# Altium schematic sheet JTAG.SchDoc
size A4; PageSetup: Record=PageOptions|CenterHorizontal=True|CenterVertical=True|PrintScale=0.94|XCorrection=1.00|YCorrection=1.00|PrintKind=1|BorderSize=5000000|LeftOffset=0|BottomOffset=0|Orientation=1|PaperLength=1000|PaperWidth=1000|Scale=100|PaperSource=7|PrintQuality=-4|MediaType=1|DitherType=10|PaperKind=A4|PrintScaleMode=1; DecimalNumber: Децимальный номер; HeadOfSector: Нач. сектора; MainDevice: Перв.примен.; Name: Наименование; Organization: Altium Limited; Address1: L3, 12a Rodborough Rd; Address2: Frenchs Forest; Address3: NSW; Address4: Australia 2086
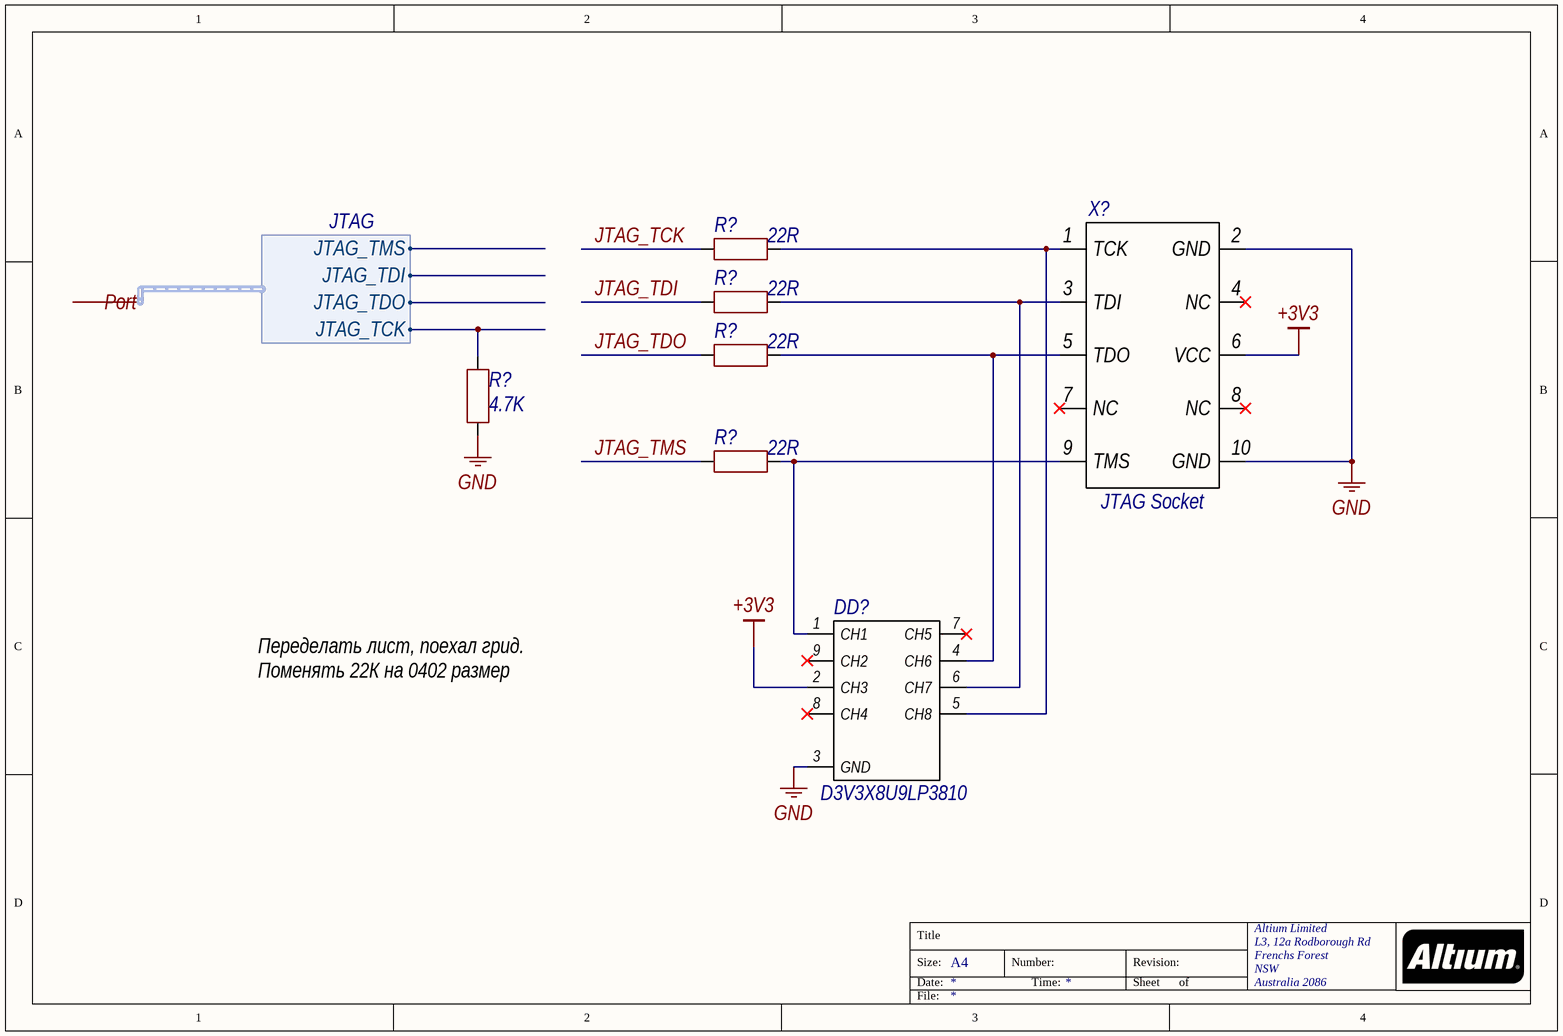
[diagram p0: JTAG.SchDoc]

## Parts
(Parts that share a designator on the sheet are numbered #1, #2 ... from top to bottom, then left to right.)
DD?  MPN: D3V3X8U9LP3810  [U-DFN3810-9]
R?#1  22R  [RESC0603N]
R?#2  22R  [RESC0603N]
R?#3  22R  [RESC0603N]
R?#4  4.7K  [RESC0402(1005)_M]
R?#5  22R  [RESC0603N]
X?  JTAG Socket  [BH-10]

## Ports
Port (harness JTAG)

## Harnesses
JTAG: JTAG_TCK, JTAG_TDI, JTAG_TDO, JTAG_TMS

## Nets
+3V3: DD?.2(CH3) X?.6(VCC)
GND: DD?.3(GND) R?#4.1 X?.2(GND) X?.10(GND)
JTAG_TCK: R?#1.1
JTAG_TDI: R?#2.1
JTAG_TDO: R?#3.1
JTAG_TMS: R?#5.1
NetDD?_1: DD?.1(CH1) R?#5.2 X?.9(TMS)
NetDD?_4: DD?.4(CH6) R?#3.2 X?.5(TDO)
NetDD?_5: DD?.5(CH8) R?#1.2 X?.1(TCK)
NetDD?_6: DD?.6(CH7) R?#2.2 X?.3(TDI)
NetR?#4_2: R?#4.2 ; port Port.JTAG_TCK

Not connected (* = marked no-connect by the designer): DD? 7(CH5)* 8(CH4)* 9(CH2)*; X? 4(NC)* 7(NC)* 8(NC)*

## Notes on the sheet
- Переделать лист, поехал грид. Поменять 22К на 0402 размер
- Title
- Size:
- Date:
- A4
- Number:
- Time:
- Revision:
- Sheet
- of
- File:

## Library data of the parts
DD? = D3V3X8U9LP3810: Manufacturer: DiodesInc; MntType: SMD; Part Number: D3V3X8U9LP3810; MSL: MSL 1; Package: =Footprint; RoHS: Comply; PartType: TVS; Pins: 9; BOMDescription: D3V3X8U9LP3810; CFootprint: =Footprint; ClassName: TVS; ComponentLink1Description: Datasheet; ComponentLink1URL: https://www.diodes.com/assets/Datasheets/D3V3X8U9LP3810.pdf
R?#1-R?#3 R?#5 = RES: Manufacturer: UNI-ROYAL; ManufacturerAlt: JLCPCB; MPN: 0603WAF220JT5E; MPNAlt: C23345; MntType: SMD; Tolerance: 1%; Voltage: 75V; Height: 0.45mm; MSL: MSL 1; Package: =Footprint; RoHS: Comply; PartType: CHIP RESISTOR; Pins: 2; BOMDescription: =MntType+' '+PartType+' '+Package+' '+Value+' '+Tolerance+' '+Voltage+' '+TempCoeff+' '+MPN; CFootprint: =Footprint; Value: 22R; Part Number: RES; ClassName: Resistor; ComponentLink1Description: Datasheet; ComponentLink1Description: New link; ComponentLink1URL: https://datasheet.lcsc.com/lcsc/1810291812_UNI-ROYAL-Uniroyal-Elec-0603WAF220JT5E_C23345.pdf
R?#4 = RES0402: Manufacturer: UNI-ROYAL; ManufacturerAlt: JLCPCB; MPN: 0402WGF4701TCE; MPNAlt: C25900; MntType: SMD; Tolerance: 1%; Voltage: 50V; Height: 0.35mm; MSL: MSL 1; Package: =Footprint; RoHS: Comply; PartType: CHIP RESISTOR; Pins: 2; BOMDescription: =MntType+' '+PartType+' '+Package+' '+Value+' '+Tolerance+' '+Voltage+' '+TempCoeff+' '+MPN; CFootprint: =Footprint; Value: 4.7K; Part Number: RES0402; ClassName: Resistor; ComponentLink1Description: Datasheet
X? = JTAG Socket 10 Pin: MntType: DIP; System: Connector; ComponentLink1Description: Datasheet; MPN: BH-10; Part Number: JTAG Socket 10 Pin; MSL: MSL 1; Package: BH-10; RoHS: Comply; PartType: CONNECTOR; Pins: 10; BOMDescription: =MntType+' '+PartType+' '+Package+' '+Value+' '+Tolerance+' '+Voltage+' '+TempCoeff+' '+MPN; CFootprint: =Footprint; ClassName: Connector; ComponentLink1URL: ***